# EAGLE design Clock (EAGLE 7.1.0)
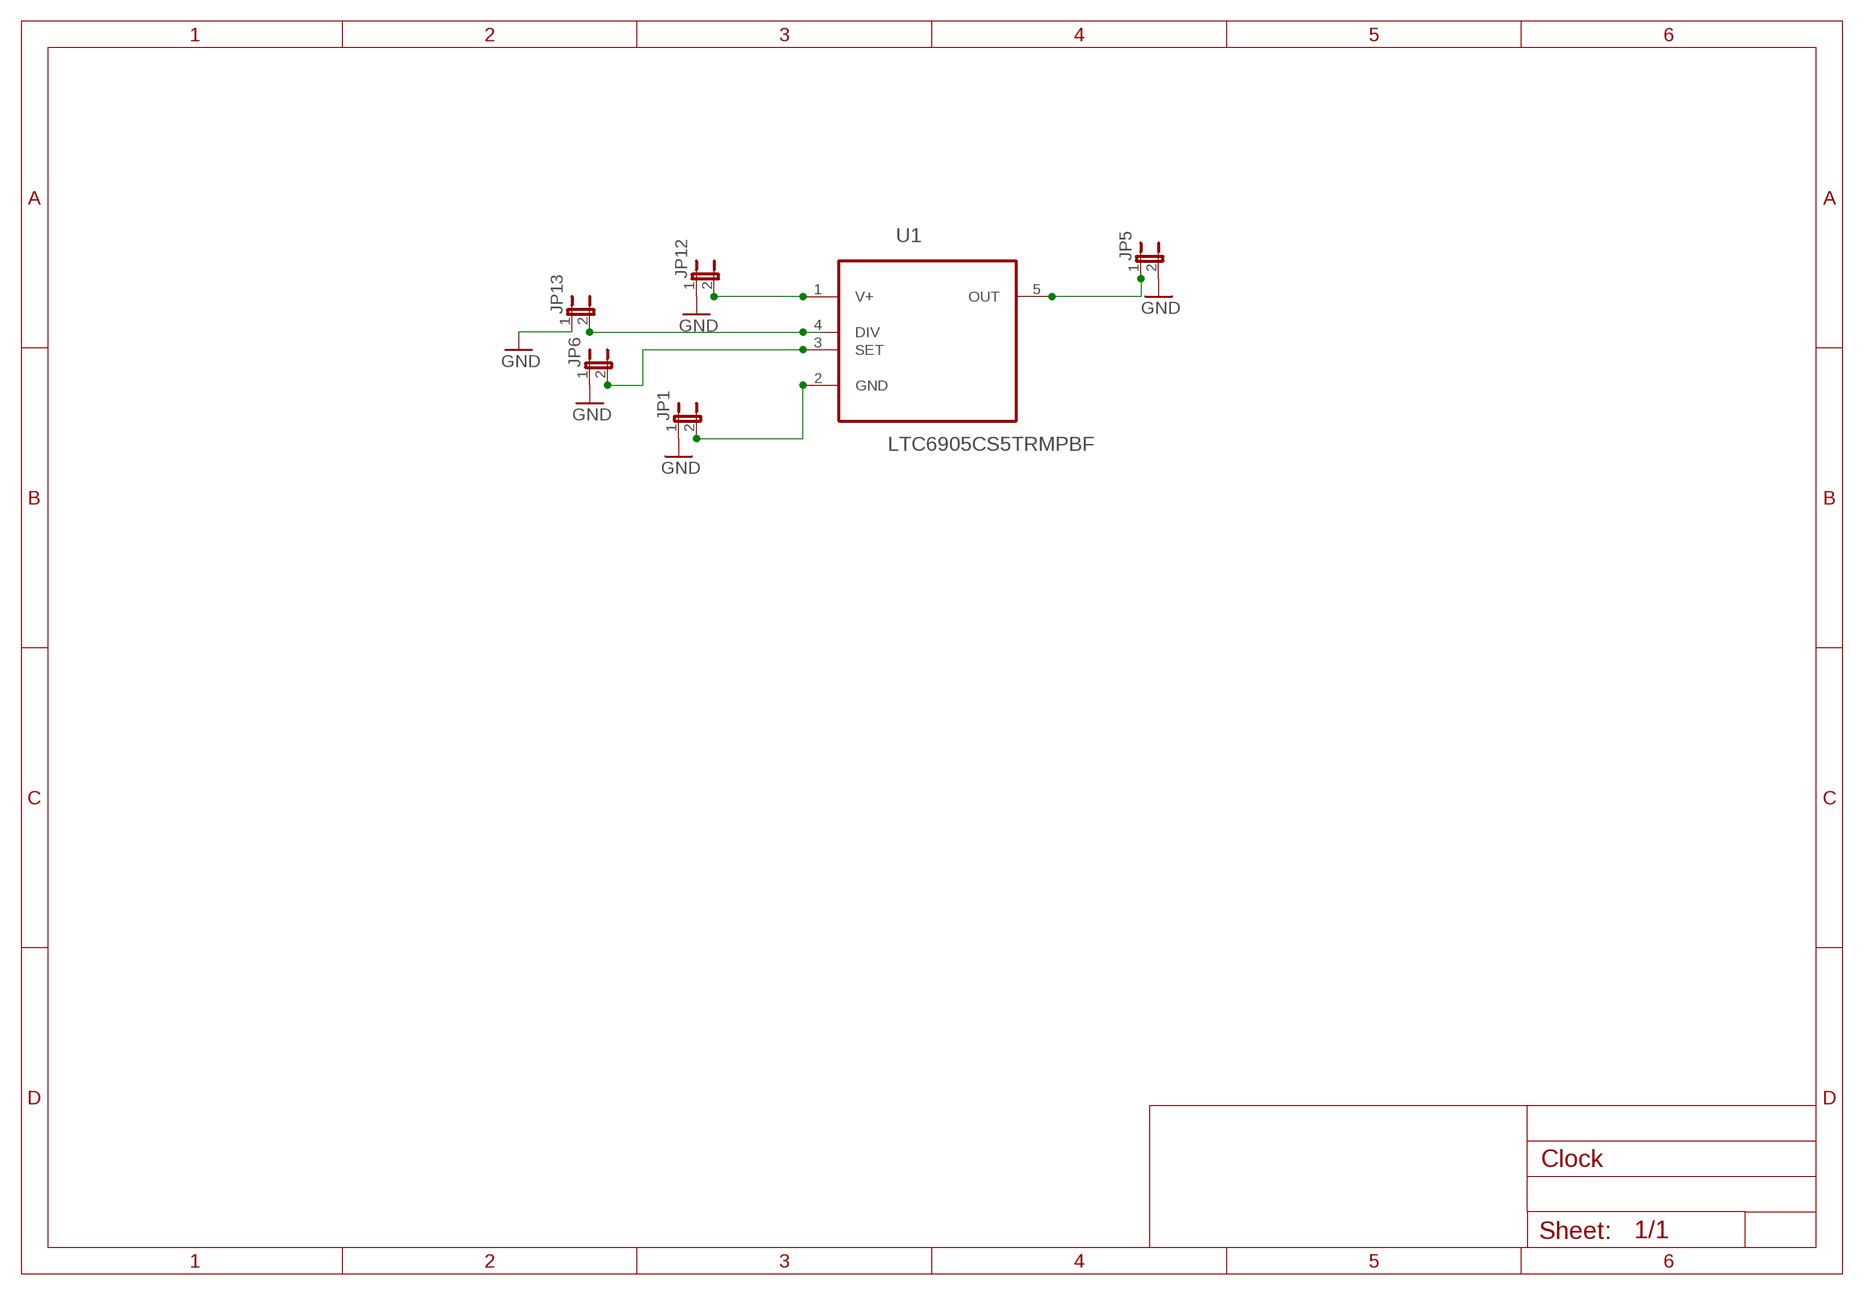
[diagram p0: schematic, sheet 1]

## Parts
JP1  JP1E  [JP1]
JP5  JP1E  [JP1]
JP6  JP1E  [JP1]
JP12  JP1E  [JP1]
JP13  JP1E  [JP1]
U1  LTC6905CS5TRMPBF  [SOT95P280X100-5N]

## Nets
GND: JP1.1 JP5.2 JP6.1 JP12.1 JP13.1
N$1: JP12.2 U1.1(V+)
N$2: JP13.2 U1.4(DIV)
N$3: JP6.2 U1.3(SET)
N$4: JP1.2 U1.2(GND)
N$5: JP5.1 U1.5(OUT)

## Library data of the parts
JP1 JP5 JP6 JP12 JP13 = jumper:JP1E: JUMPER
U1 = LTC_By_element14_Batch_1:LTC6905CS5TRMPBF: 17MHz to 170MHz Resistor Oscillator; MPN: LTC6905CS5#TRMPBF; OC_FARNELL: 1663923; OC_NEWARK: 19P0750; PACKAGE: SOT-23-5; SUPPLIER: Linear Technology

## Board
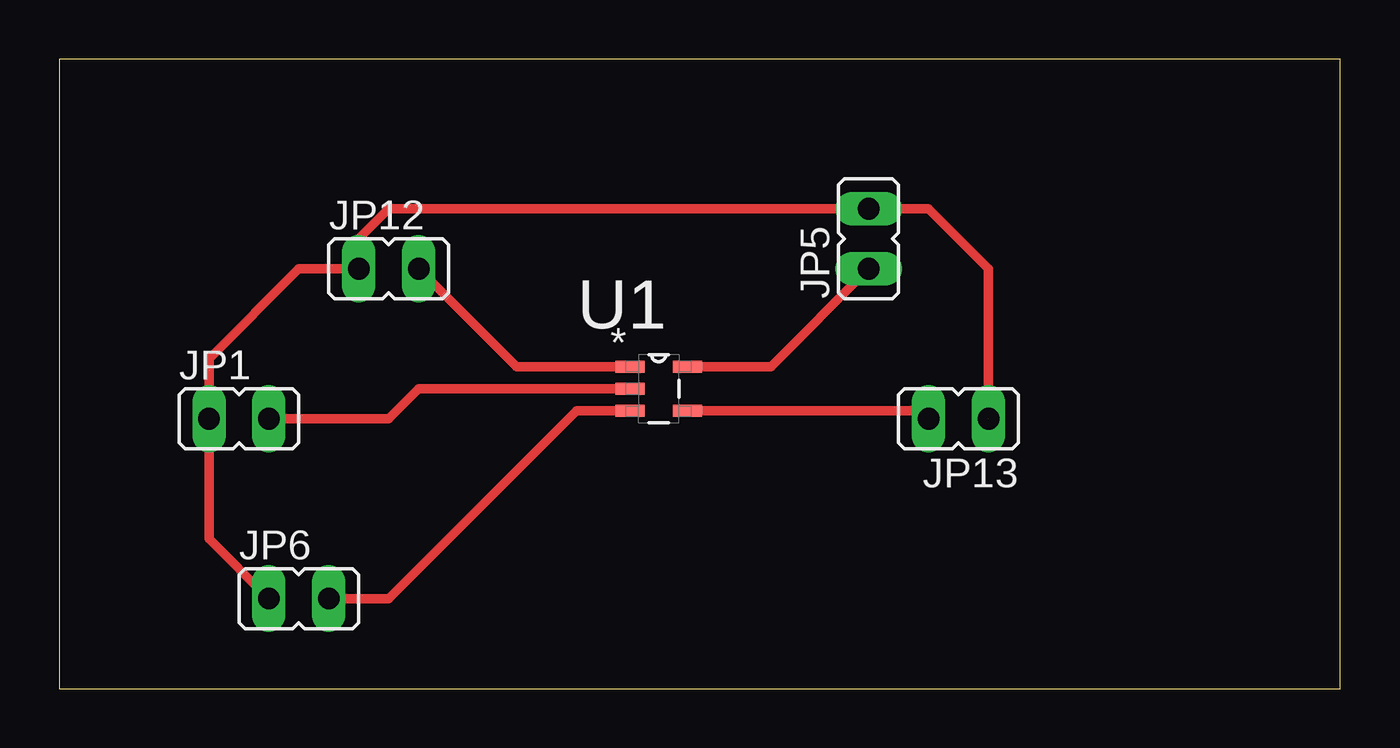
[diagram p1: board, top side]

Size 54.28 x 26.66 mm. Coordinates in mm from the lower left corner, seen from the top.
Outline: 0,0 54.28,0 54.28,26.66 0,26.66 0,0
Copper layers (1*16): Top 0.035mm / dielectric 1.5mm / Bottom 0.035mm
Design rules "default": minimum track width 10mil, minimum drill 24mil, track to track 8mil, track to pad 8mil, pad to pad 8mil, via to via 8mil, smd to smd 8mil, copper to edge 40mil, drill to drill 8mil, minimum pad ring 10mil, minimum via ring 8mil, stop-mask expansion 4mil, vias tented up to drill 0mil, thermal gap 10mil

### Footprints (pad centres in the part's own frame; a part is rotated, then mirrored left to right if it is on the bottom)
JP1 = drill 0.914 long: 1 0,-1.27; 2 0,1.27
SOT95P280X100-5N = smd 1.219 x 0.508: 1 -1.219,0.94; 2 -1.219,0; 3 -1.219,-0.94; 4 1.219,-0.94; 5 1.219,0.94

### Placement (x,y rotation side)
JP1  7.62,11.43 270 top
JP5  34.29,19.05 0 top
JP6  10.16,3.81 270 top
JP12  13.97,17.78 270 top
JP13  38.1,11.43 90 top
U1  25.4,12.7 0 top

### Tracks (layer width: path | path; a pad name or v marks a point on that pad's centre or on a via)
GND  (1 unrouted)
  Top 0.406: JP13.1 39.37,17.78 36.83,20.32 JP5.2 13.97,20.32 12.7,19.05 JP12.1 10.16,17.78 6.35,13.97 JP1.1 6.35,6.35 JP6.1
N$1
  Top 0.406: U1.1 19.38,13.64 JP12.2
N$2
  Top 0.406: U1.4 36.5,11.76 JP13.2
N$3
  Top 0.406: U1.3 21.92,11.76 13.97,3.81 JP6.2
N$4
  Top 0.406: U1.2 15.24,12.7 13.97,11.43 JP1.2
N$5
  Top 0.406: U1.5 30.15,13.64 JP5.1